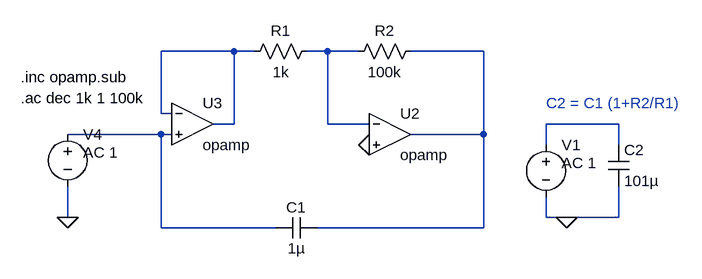
[diagram p0: schematic EJE3_C.asc]
EJE3_C.asc, the LTspice schematic file:
Version 4
SHEET 1 880 680
WIRE -800 -400 -912 -400
WIRE -768 -400 -800 -400
WIRE -656 -400 -688 -400
WIRE -608 -400 -656 -400
WIRE -416 -400 -528 -400
WIRE -912 -304 -912 -400
WIRE -896 -304 -912 -304
WIRE -800 -288 -800 -400
WIRE -800 -288 -832 -288
WIRE -656 -288 -656 -400
WIRE -592 -288 -656 -288
WIRE -208 -288 -320 -288
WIRE -912 -272 -1056 -272
WIRE -896 -272 -912 -272
WIRE -416 -272 -416 -400
WIRE -416 -272 -528 -272
WIRE -320 -256 -320 -288
WIRE -208 -256 -208 -288
WIRE -1056 -144 -1056 -192
WIRE -320 -144 -320 -176
WIRE -288 -144 -320 -144
WIRE -208 -144 -208 -192
WIRE -208 -144 -288 -144
WIRE -912 -128 -912 -272
WIRE -736 -128 -912 -128
WIRE -416 -128 -416 -272
WIRE -416 -128 -672 -128
FLAG -1056 -144 0
FLAG -592 -256 0
FLAG -288 -144 0
SYMBOL voltage -1056 -288 R0
WINDOW 123 24 44 Left 2
WINDOW 39 0 0 Left 0
SYMATTR Value2 AC 1
SYMATTR InstName V4
SYMATTR Value ""
SYMBOL cap -672 -144 R90
WINDOW 0 0 32 VBottom 2
WINDOW 3 32 32 VTop 2
SYMATTR InstName C1
SYMATTR Value 1µ
SYMBOL res -512 -416 R90
WINDOW 0 0 56 VBottom 2
WINDOW 3 32 56 VTop 2
SYMATTR InstName R2
SYMATTR Value 100k
SYMBOL res -672 -416 R90
WINDOW 0 0 56 VBottom 2
WINDOW 3 32 56 VTop 2
SYMATTR InstName R1
SYMATTR Value 1k
SYMBOL OpAmps\\opamp -560 -336 R0
SYMATTR InstName U2
SYMBOL OpAmps\\opamp -864 -352 R0
SYMATTR InstName U3
SYMBOL cap -224 -256 R0
SYMATTR InstName C2
SYMATTR Value 101µ
SYMBOL voltage -320 -272 R0
WINDOW 123 24 44 Left 2
WINDOW 39 0 0 Left 0
SYMATTR Value2 AC 1
SYMATTR InstName V1
SYMATTR Value ""
TEXT -1128 -328 Left 2 !.ac dec 1k 1 100k
TEXT -1128 -360 Left 2 !.inc opamp.sub
TEXT -320 -320 Left 2 ;C2 = C1 (1+R2/R1)

The netlist it stands for:
* EJE3_C.asc
V4 N005 0 AC 1
C1 N003 N005 1µ
R2 N003 N002 100k
R1 N002 N001 1k
XU2 N002 0 N003 opamp Aol=100K GBW=10Meg  ; pins invin noninvin out
XU3 N001 N005 N001 opamp Aol=100K GBW=10Meg  ; pins invin noninvin out
C2 N004 0 101µ
V1 N004 0 AC 1
.ac dec 1k 1 100k
.inc opamp.sub
* C2 = C1 (1+R2/R1)
.backanno
.end